# Altium schematic sheet Door Buttons.SchDoc: TITLE
size A4; Address1: ludzinc.blogspot.com.au; Address3: www.lowcostlabs.com.au; DocumentNumber: LCL_004; Revision: V2.00; SheetNumber: 8; SheetTotal: 8
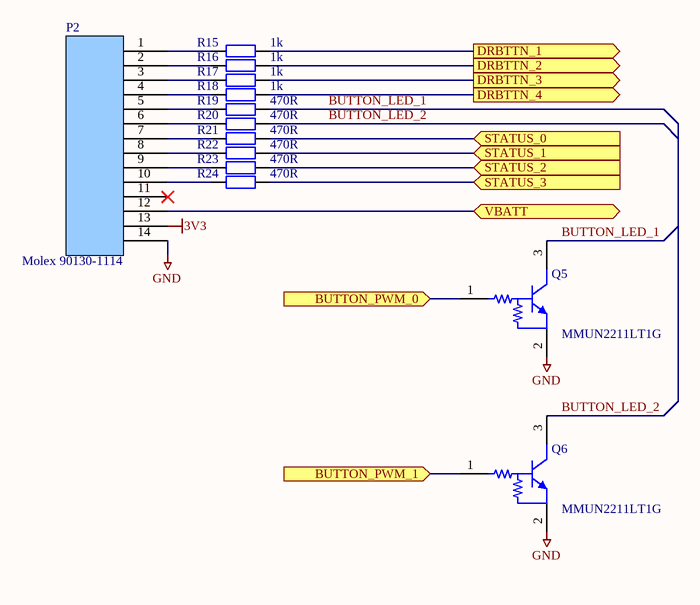
[diagram p0: Door Buttons.SchDoc]

## Parts
P2  Molex 90130-1114  [PCB-642648-1]
Q5  MMUN2211LT1G  [ONSC-SOT-23-3-318-08_V]
Q6  MMUN2211LT1G  [ONSC-SOT-23-3-318-08_V]
R15  1k  [PCB-3652081-2]
R16  1k  [PCB-3652081-2]
R17  1k  [PCB-3652081-2]
R18  1k  [PCB-3652081-2]
R19  470R  [PCB-3652081-2]
R20  470R  [PCB-3652081-2]
R21  470R  [PCB-3652081-2]
R22  470R  [PCB-3652081-2]
R23  470R  [PCB-3652081-2]
R24  470R  [PCB-3652081-2]

## Ports
BUTTON_PWM_0 (in), BUTTON_PWM_1 (in), DRBTTN_1 (out), DRBTTN_2 (out), DRBTTN_3 (out), DRBTTN_4 (out), STATUS_0 (in), STATUS_1 (in), STATUS_2 (in), STATUS_3 (in), VBATT

## Nets
3V3: P2.13
GND: P2.14 Q5.2(E) Q6.2(E)
BUTTON_LED_1: Q5.3(C) R19.2
BUTTON_LED_2: Q6.3(C) R20.2
BUTTON_PWM_0: Q5.1(B) ; port BUTTON_PWM_0
BUTTON_PWM_1: Q6.1(B) ; port BUTTON_PWM_1
DRBTTN_1: R15.2 ; port DRBTTN_1
DRBTTN_2: R16.2 ; port DRBTTN_2
DRBTTN_3: R17.2 ; port DRBTTN_3
DRBTTN_4: R18.2 ; port DRBTTN_4
STATUS_0: R21.2 ; port STATUS_0
STATUS_1: R22.2 ; port STATUS_1
STATUS_2: R23.2 ; port STATUS_2
STATUS_3: R24.2 ; port STATUS_3
VBATT: P2.12 ; port VBATT
NetP2_1: P2.1 R15.1
NetP2_2: P2.2 R16.1
NetP2_3: P2.3 R17.1
NetP2_4: P2.4 R18.1
NetP2_5: P2.5 R19.1
NetP2_6: P2.6 R20.1
NetP2_7: P2.7 R21.1
NetP2_8: P2.8 R22.1
NetP2_9: P2.9 R23.1
NetP2_10: P2.10 R24.1

Not connected (* = marked no-connect by the designer): P2 11*

## Notes on the sheet
- LOW COST LABS
- Title
- Size:
- Date:
- A4
- Number:
- Revision:
- Sheet
- of
- File:

## Library data of the parts
P2 = CMP-f8023102ddab27c5-1: Conn Shrouded Header HDR 14 POS 2.54mm Solder ST Thru-Hole C-Grid IIIáTray; Current Rating: 3.00 A; Gender: Male; Glow Wire Compliant: Non-Compliant; Lead-Free Status: Lead Free; Number of Circuits: 12, 14; Number of Contacts: 14; Octopart URL: https://octopart.com/90130-1114-molex-655567; Manufacturer Part Number: 90130-1114; Color: Black; Contact Material: Brass; Contact Plating: Tin; Halogen Free Status: Not Low Halogen; Housing Color: Black; Housing Material: Plastic; Lifecycle Status: Active; Mounting Style: Through Hole, Vertical; Number of Positions: 14; Number of Rows: 2; Operating Temperature: 125 °C (max); Orientation: Straight; Packaging: Tray; Pin Pitch: 2.54 mm; RoHS: Compliant; Size-Height: 10.9 mm; Size-Length: 20.5 mm; Size-Width: 9.75 mm; OctopartID: f8023102ddab27c5
Q5 Q6 = CMP-866803-1: Digital Transistor (BRT), R1=10 kOhm, R2=10 kOhm, NPN Transistor, 3-Pin SOT-23, Pb-Free, Tape and Reel; SVHC: No SVHC (19-Dec-2012); Transistor Type: Bias Resistor (BRT); Power Dissipation Pd: 246mW; Collector Emitter Voltage Vces: -250mV; Pin Configuration: 1; Voltage Vcbo: 50V; No. of Pins: 3; Current Ic hFE: 5mA; DC Collector Current: 100mA; DC Current Gain hFE: 60; SMD Marking: A8A; Power Dissipation Ptot Max: 200mW; CiivaID: 866803; Hfe Min: 35; Resistance R1: 10kohm; Transistor Case Style: SOT-23; Transistor Polarity: NPN; Collector Emitter Voltage V(br)ceo: 50V; Ciiva URL: https://ciiva.com/part/MMUN2211LT1G-866803; Package / Case: SOT-23; No. of Transistors: 1; Resistance R2: 10kohm
R15-R24 = CMP-rprrpiwz7au7w5x5ojb2-2: GENERIC 0805 RESISTOR; CustomComponentID: rprrpiwz7au7w5x5ojb2